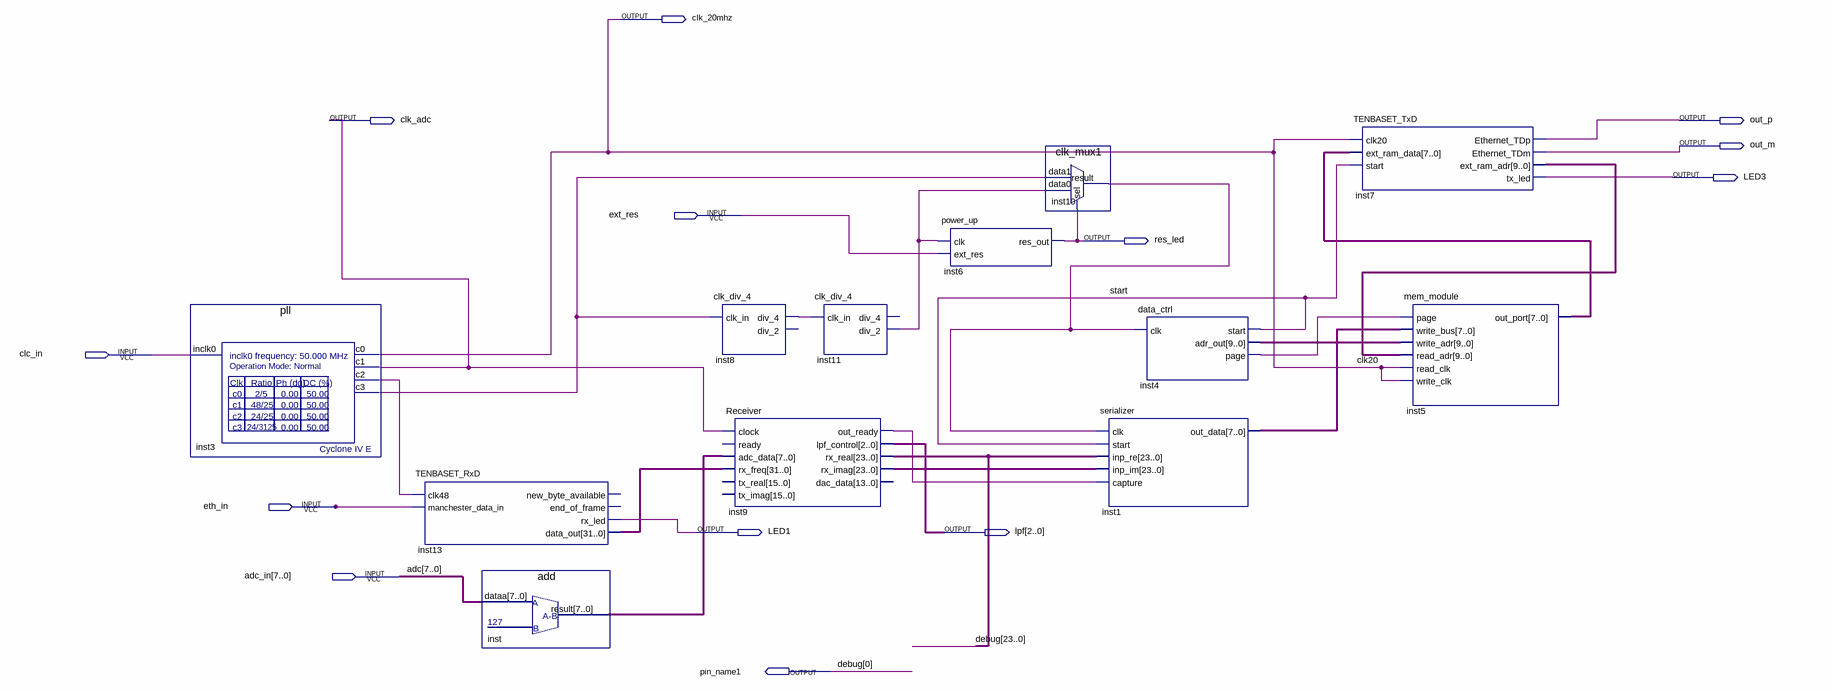
[diagram p0: schematic sheet]
// Quartus schematic trx.bdf as structural Verilog: 12 symbols, 13 pins
module trx (
  input  ext_res,
  input  clc_in,
  input  eth_in,
  input  [7:0] adc_in,
  output clk_20mhz,
  output clk_adc,
  output out_p,
  output out_m,
  output LED3,
  output res_led,
  output LED1,
  output [2:0] lpf,
  output pin_name1
);

  wire inst3_c2, inst3_c3, inst4_page, inst8_div_4, inst9_out_ready, inst10_result, inst11_div_2, start;
  wire [7:0] inst1_out_data, inst5_out_port, inst_result;
  wire [9:0] inst4_adr_out, inst7_ext_ram_adr;
  wire [23:0] inst9_rx_imag;
  wire [23:1] debug;
  wire [31:0] inst13_data_out;

  pll inst3 (.inclk0(clc_in), .c0(clk_20mhz), .c1(clk_adc), .c2(inst3_c2), .c3(inst3_c3));
  TENBASET_RxD inst13 (
    .clk48(inst3_c2), .manchester_data_in(eth_in), .rx_led(LED1), .data_out(inst13_data_out));  // open: new_byte_available, end_of_frame
  add inst (.dataa(adc_in), .result(inst_result));
  clk_div_4 inst8 (.clk_in(inst3_c3), .div_4(inst8_div_4));  // open: div_2
  Receiver inst9 (
    .clock(clk_adc), .adc_data(inst_result), .rx_freq(inst13_data_out), .out_ready(inst9_out_ready),
    .lpf_control(lpf), .rx_real({debug, pin_name1}), .rx_imag(inst9_rx_imag));  // open: ready, tx_real, tx_imag, dac_data
  clk_div_4 inst11 (.clk_in(inst8_div_4), .div_2(inst11_div_2));  // open: div_4
  power_up inst6 (.clk(inst11_div_2), .ext_res(ext_res), .res_out(res_led));
  clk_mux1 inst10 (.data1(inst3_c3), .data0(inst11_div_2), .sel(res_led), .result(inst10_result));
  serializer inst1 (
    .clk(inst10_result), .start(start), .inp_re({debug, pin_name1}), .inp_im(inst9_rx_imag),
    .capture(inst9_out_ready), .out_data(inst1_out_data));
  data_ctrl inst4 (.clk(inst10_result), .start(start), .adr_out(inst4_adr_out), .page(inst4_page));
  TENBASET_TxD inst7 (
    .clk20(clk_20mhz), .ext_ram_data(inst5_out_port), .start(start), .Ethernet_TDp(out_p),
    .Ethernet_TDm(out_m), .ext_ram_adr(inst7_ext_ram_adr), .tx_led(LED3));
  mem_module inst5 (
    .page(inst4_page), .write_bus(inst1_out_data), .write_adr(inst4_adr_out), .read_adr(inst7_ext_ram_adr),
    .read_clk(clk_20mhz), .write_clk(clk_20mhz), .out_port(inst5_out_port));

  // Other names for the same wires on the sheet: adc[7:0] = adc_in; clk20 = clk_20mhz; debug[0] = pin_name1
endmodule
